# Altium schematic sheet Main.SchDoc
size A4; SheetNumber: 1; SheetTotal: 6
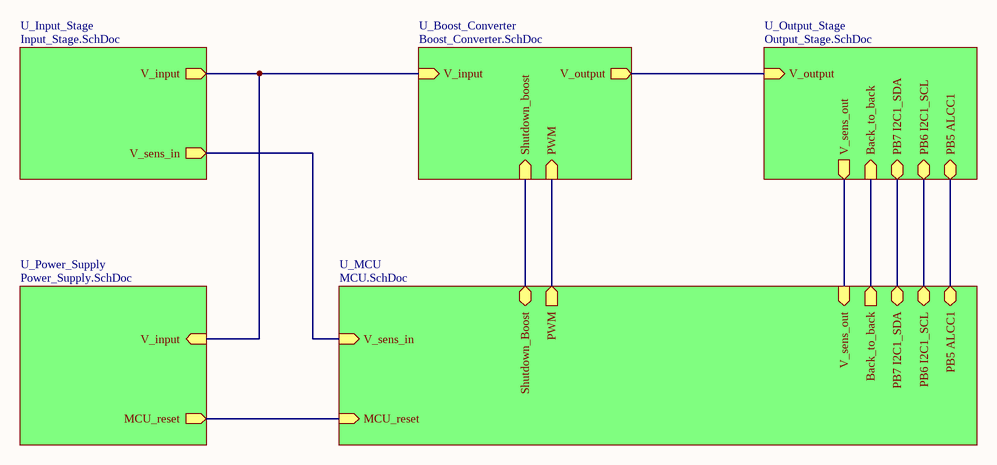
[diagram p0: Main.SchDoc]

## Sub-sheets
U_Boost_Converter = Boost_Converter.SchDoc: PWM (in), V_input (in), Shutdown_boost (in), V_output (out)
U_Input_Stage = Input_Stage.SchDoc: V_sens_in (out), V_input (out)
U_MCU = MCU.SchDoc: PWM (out), V_sens_in (in), Shutdown_Boost (bidir), PB6 I2C1_SCL (bidir), V_sens_out (in), PB7 I2C1_SDA (bidir), MCU_reset (in), PB5 ALCC1 (bidir), Back_to_back (out)
U_Output_Stage = Output_Stage.SchDoc: V_sens_out (out), V_output (in), PB7 I2C1_SDA (bidir), PB6 I2C1_SCL (bidir), PB5 ALCC1 (bidir), Back_to_back (in)
U_Power_Supply = Power_Supply.SchDoc: MCU_reset (out), V_input (in)  | Name: Power_Supply

## Nets
(unnamed): sheet U_Input_Stage/V_sens_in, sheet U_MCU/V_sens_in
(unnamed): sheet U_Input_Stage/V_input, sheet U_Boost_Converter/V_input, sheet U_Power_Supply/V_input
(unnamed): sheet U_Boost_Converter/PWM, sheet U_MCU/PWM
(unnamed): sheet U_Boost_Converter/Shutdown_boost, sheet U_MCU/Shutdown_Boost
(unnamed): sheet U_Boost_Converter/V_output, sheet U_Output_Stage/V_output
(unnamed): sheet U_Output_Stage/V_sens_out, sheet U_MCU/V_sens_out
(unnamed): sheet U_Output_Stage/PB7 I2C1_SDA, sheet U_MCU/PB7 I2C1_SDA
(unnamed): sheet U_Output_Stage/PB6 I2C1_SCL, sheet U_MCU/PB6 I2C1_SCL
(unnamed): sheet U_Output_Stage/PB5 ALCC1, sheet U_MCU/PB5 ALCC1
(unnamed): sheet U_Output_Stage/Back_to_back, sheet U_MCU/Back_to_back
(unnamed): sheet U_Power_Supply/MCU_reset, sheet U_MCU/MCU_reset